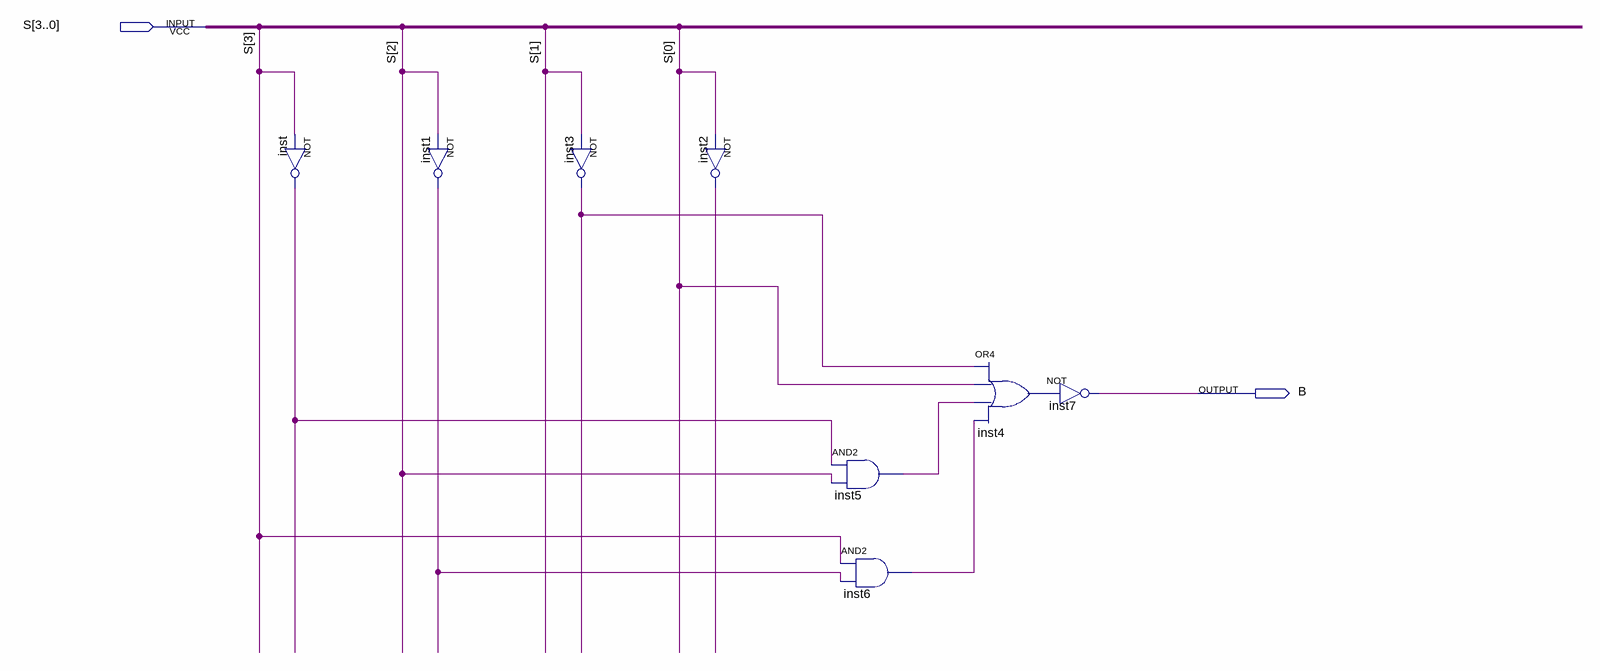
[diagram p0: schematic sheet]
// Quartus schematic DisplayB.bdf as structural Verilog: 8 symbols, 2 pins
module DisplayB (
  input  [3:0] S,
  output B
);

  wire inst1_out, inst2_out, inst3_out, inst4_out, inst5_out, inst6_out, inst_out;

  not inst (inst_out, S[3]);
  not inst1 (inst1_out, S[2]);
  not inst3 (inst3_out, S[1]);
  not inst2 (inst2_out, S[0]);
  and inst5 (inst5_out, inst_out, S[2]);
  and inst6 (inst6_out, S[3], inst1_out);
  or inst4 (inst4_out, inst3_out, S[0], inst5_out, inst6_out);
  not inst7 (B, inst4_out);
endmodule
